# EAGLE design ARM_PDU (EAGLE 9.4.1)
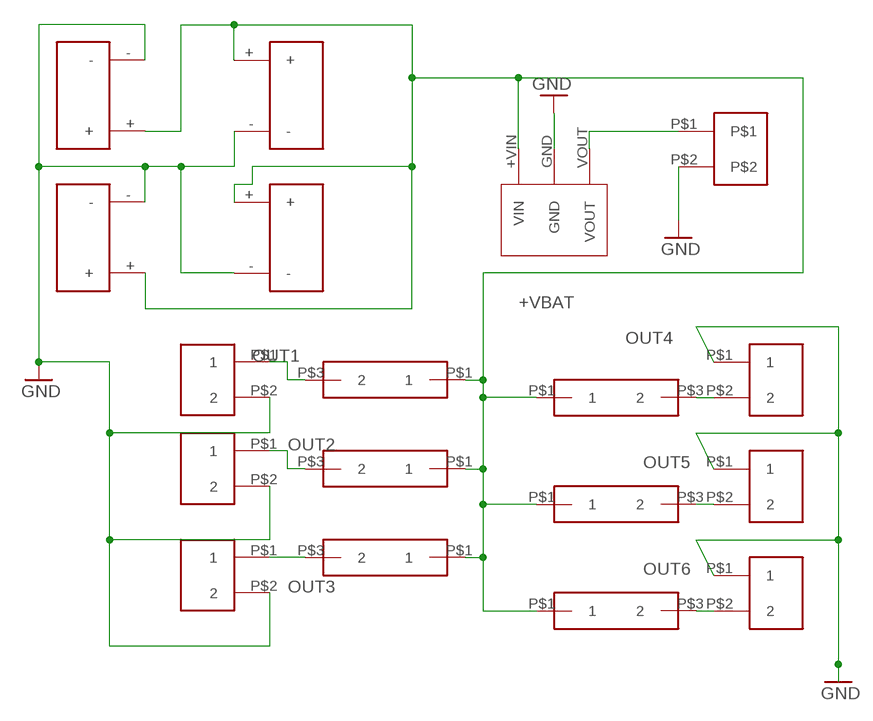
[diagram p0: schematic, sheet 1]

## Parts
U$1  20A_FUSE_HOLDER  [20A_FUSE_HOLDER]
U$2  20A_FUSE_HOLDER  [20A_FUSE_HOLDER]
U$3  20A_FUSE_HOLDER  [20A_FUSE_HOLDER]
U$4  PP45_HOR_2BOT  [PP45_HOR_2BOT]
U$5  PP45_HOR_2BOT  [PP45_HOR_2BOT]
U$6  PP45_HOR_2BOT  [PP45_HOR_2BOT]
U$7  PP45_HOR_2BOT  [PP45_HOR_2BOT]
U$8  AMP-MTE-2MALE  [AMP-MTE-2MALE]
U$9  R-78E3.3-0.5  [R-78E3.3-0.5]
U$10  2PIN_5MM  [2PIN_5MM]
U$11  2PIN_5MM  [2PIN_5MM]
U$12  2PIN_5MM  [2PIN_5MM]
U$13  2PIN_5MM  [2PIN_5MM]
U$14  20A_FUSE_HOLDER  [20A_FUSE_HOLDER]
U$15  20A_FUSE_HOLDER  [20A_FUSE_HOLDER]
U$16  20A_FUSE_HOLDER  [20A_FUSE_HOLDER]
U$17  2PIN_5MM  [2PIN_5MM]
U$18  2PIN_5MM  [2PIN_5MM]

## Nets
+VBAT: U$1.P$1 U$2.P$1 U$3.P$1 U$4.+ U$5.+ U$6.+ U$7.+ U$9.+VIN(VIN) U$14.P$1 U$15.P$1 U$16.P$1
GND: U$4.- U$5.- U$6.- U$7.- U$8.P$2 U$9.GND U$10.P$1 U$11.P$1 U$12.P$1 U$13.P$2 U$17.P$2 U$18.P$2
N$2: U$8.P$1 U$9.VOUT
OUT1: U$1.P$3 U$13.P$1
OUT2: U$2.P$3 U$17.P$1
OUT3: U$3.P$3 U$18.P$1
OUT4: U$10.P$2 U$16.P$3
OUT5: U$11.P$2 U$15.P$3
OUT6: U$12.P$2 U$14.P$3

## Library data of the parts
U$1-U$3 U$14-U$16 = 20A_FUSE_HOLDER:20A_FUSE_HOLDER
U$4-U$7 = SPEAR:PP45_HOR_2BOT
U$8 = SPEAR:AMP-MTE-2MALE
U$9 = SPEAR-PDU:R-78E3.3-0.5
U$10-U$13 U$17 U$18 = SPEAR-arm-pdu:2PIN_5MM

## Board
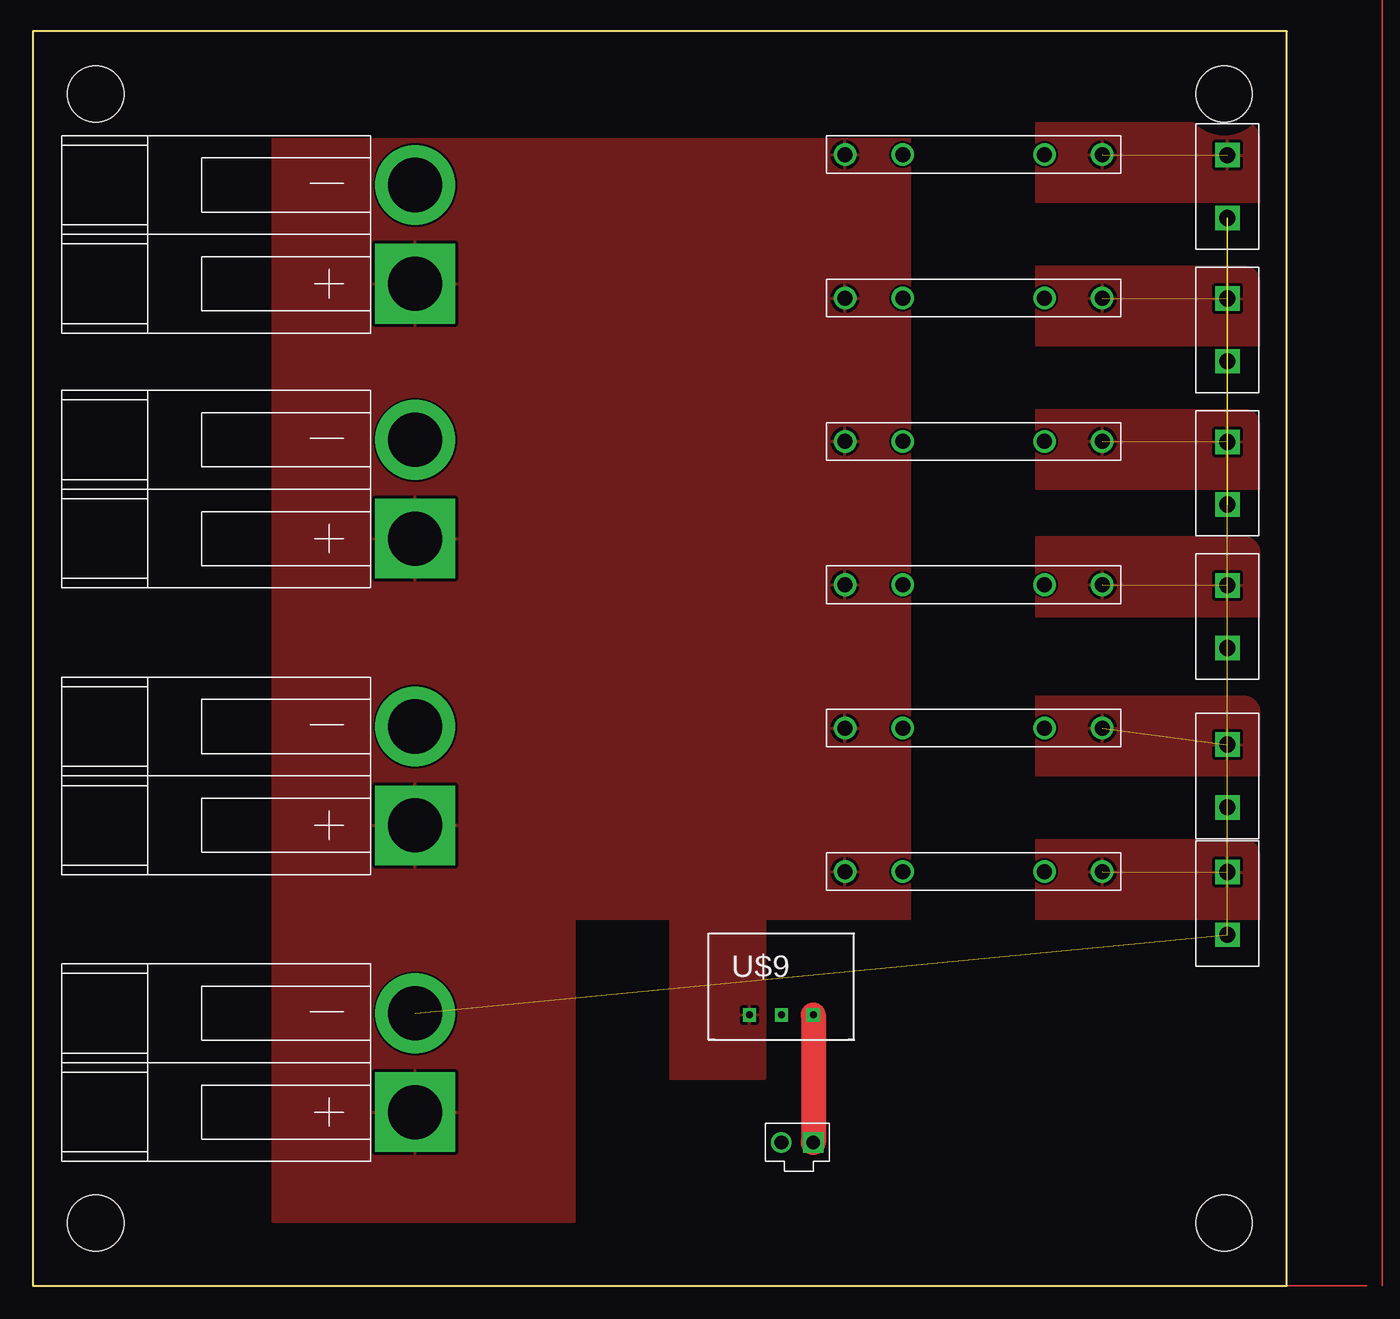
[diagram p1: board, top side]
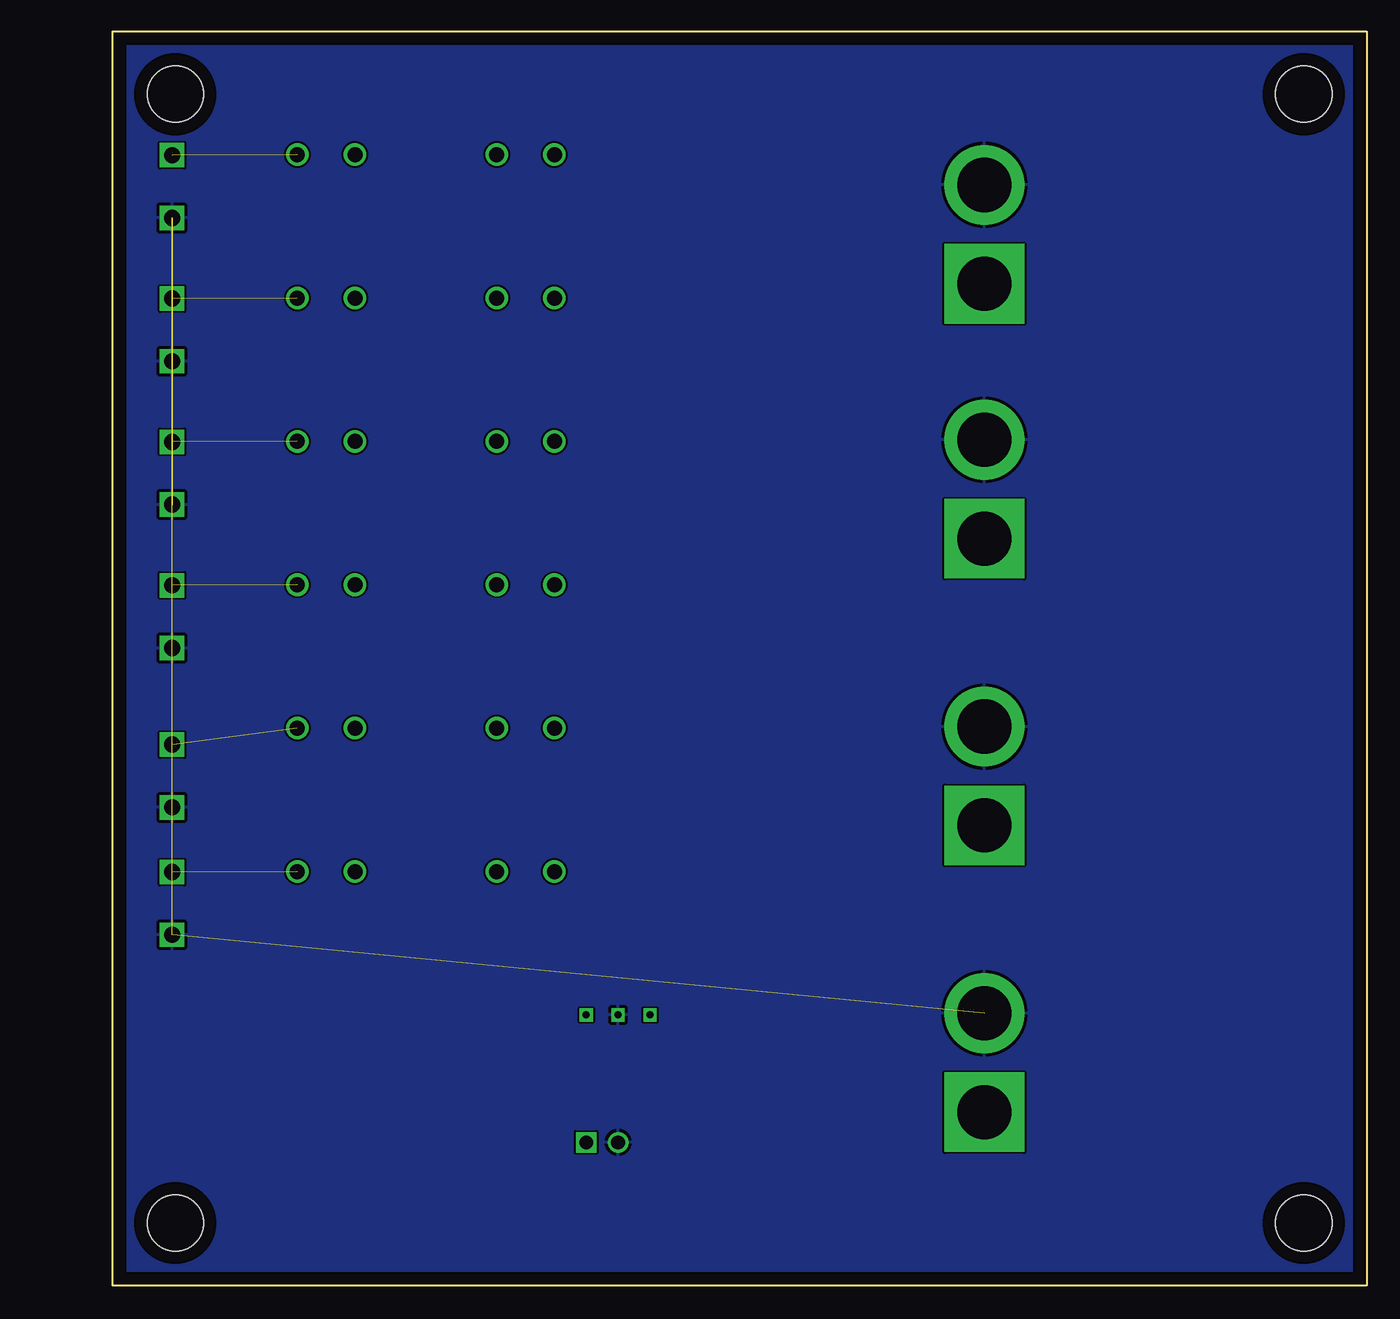
[diagram p2: board, bottom side, seen from below]

Size 100 x 100 mm. Coordinates in mm from the lower left corner, seen from the top.
Outline: 0,0 100,0 100,100 0,100 0,0
Copper layers (1*16): Top 0.035mm / dielectric 1.5mm / Bottom 0.035mm
Design rules "default": minimum track width 6mil, minimum drill 0.35mm, track to track 6mil, track to pad 6mil, pad to pad 6mil, via to via 6mil, smd to smd 6mil, copper to edge 40mil, drill to drill 6mil, minimum pad ring 10mil, minimum via ring 8mil, stop-mask expansion 4mil, vias tented up to drill 0mil, thermal gap 10mil
Holes 4.5 mm at 5,5 95,5 5,95 95,95

### Footprints (pad centres in the part's own frame; a part is rotated, then mirrored left to right if it is on the bottom)
20A_FUSE_HOLDER = drill 1.2: P$1 0,0; P$2 4.6,0; P$3 20.5,0; P$4 15.9,0
PP45_HOR_2BOT = drill 4.318 pad 6.35 square: + 0,3.937 | drill 4.318 pad 6.35: - 0,-3.937
AMP-MTE-2MALE = drill 1.092 square: P$1 -1.27,0 | drill 1.092: P$2 1.27,0
R-78E3.3-0.5 = drill 0.55 square: +VIN -2.54,0; GND 0,0; VOUT 2.54,0
2PIN_5MM = drill 1.3 square: P$1 -2.5,0; P$2 2.5,0

### Placement (x,y rotation side)
U$1  64.77,90.17 0 top
U$2  64.77,78.74 0 top
U$3  64.77,67.31 0 top
U$4  30.48,83.82 180 top
U$5  30.48,63.5 180 top
U$6  30.48,40.64 180 top
U$7  30.48,17.78 180 top
U$8  60.96,11.43 180 top
U$9  59.69,21.59 0 top
U$10  95.25,30.48 90 top
U$11  95.25,40.64 90 top
U$12  95.25,53.34 90 top
U$13  95.25,87.63 270 top
U$14  64.77,55.88 0 top
U$15  64.77,44.45 0 top
U$16  64.77,33.02 0 top
U$17  95.25,76.2 270 top
U$18  95.25,64.77 270 top

### Tracks (layer width: path | path; a pad name or v marks a point on that pad's centre or on a via)
+VBAT
  pour Top: 19.13,91.44 69.93,91.44 69.93,29.21 43.18,29.21 43.18,5.08 19.13,5.08
  pour Top: 50.8,31.75 50.8,16.51 58.42,16.51 58.42,31.75
GND  (6 unrouted)
  pour Bottom: -7.46,110.33 -7.46,-7.46 104.14,-7.46 104.14,110.33
N$2
  Top 2: U$9.VOUT U$8.P$1
OUT1  (1 unrouted)
  pour Top: 80.01,92.71 96.52,92.71 arc-90 97.79,91.44 97.79,86.36 80.01,86.36
OUT2  (1 unrouted)
  pour Top: 80.01,81.28 96.52,81.28 arc-90 97.79,80.01 97.79,74.93 80.01,74.93
OUT3  (1 unrouted)
  pour Top: 80.01,69.85 96.52,69.85 arc-90 97.79,68.58 97.79,63.5 80.01,63.5
OUT4  (1 unrouted)
  pour Top: 80.01,35.56 96.52,35.56 arc-90 97.79,34.29 97.79,29.21 80.01,29.21
OUT5  (1 unrouted)
  pour Top: 80.01,46.99 96.52,46.99 arc-90 97.79,45.72 97.79,40.64 80.01,40.64
OUT6  (1 unrouted)
  pour Top: 80.01,59.69 96.52,59.69 arc-90 97.79,58.42 97.79,53.34 80.01,53.34
(copper drawn outside any net)
  shapes: Top area x2

### Text on the board
Name: SPEAR 2019 / JACK DE WIT